# Altium schematic sheet Block_Diagram.SchDoc
size A3
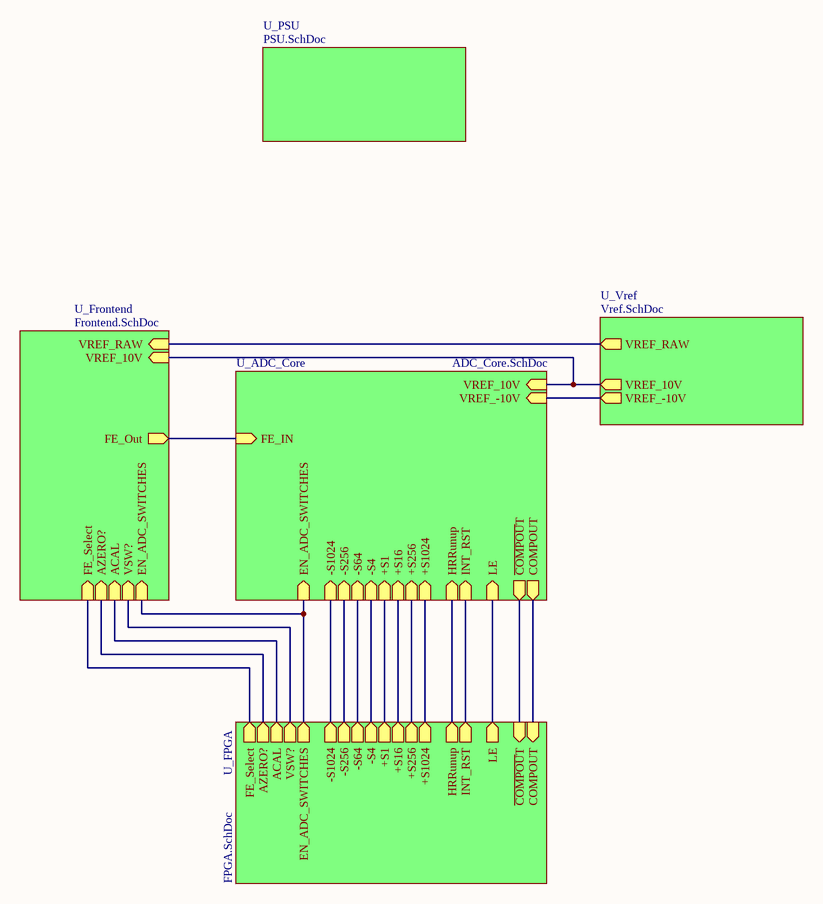
[diagram p0: Block_Diagram.SchDoc]

## Sub-sheets
U_ADC_Core = ADC_Core.SchDoc: FE_IN (in), -S64 (in), -S1024 (in), COMPOUT (out), +S16 (in), +S1024 (in), +S256 (in), LE (in), -S4 (in), INT_RST (in), ~{COMPOU}T (out), -S256 (in), HRRunup (in), +S1 (in), VREF_10V (in), VREF_-10V (in), EN_ADC_SWITCHES (in)
U_FPGA = FPGA.SchDoc: COMPOUT (in), ~{COMPOU}T (in), LE (out), INT_RST (out), HRRunup (out), +S1024 (out), +S256 (out), +S16 (out), +S1 (out), -S4 (out), -S64 (out), -S256 (out), -S1024 (out), EN_ADC_SWITCHES (out), VSW? (out), ACAL (out), AZERO? (out), FE_Select (out)
U_Frontend = Frontend.SchDoc: FE_Out (out), VREF_10V (in), VSW? (in), FE_Select (in), AZERO? (in), ACAL (in), VREF_RAW (in), EN_ADC_SWITCHES (in)
U_PSU = PSU.SchDoc: no entries
U_Vref = Vref.SchDoc: VREF_10V (out), VREF_-10V (out), VREF_RAW (out)

## Nets
(unnamed): sheet U_ADC_Core/FE_IN, sheet U_Frontend/FE_Out
(unnamed): sheet U_ADC_Core/-S64, sheet U_FPGA/-S64
(unnamed): sheet U_ADC_Core/-S1024, sheet U_FPGA/-S1024
(unnamed): sheet U_ADC_Core/COMPOUT, sheet U_FPGA/COMPOUT
(unnamed): sheet U_ADC_Core/+S16, sheet U_FPGA/+S16
(unnamed): sheet U_ADC_Core/+S1024, sheet U_FPGA/+S1024
(unnamed): sheet U_ADC_Core/+S256, sheet U_FPGA/+S256
(unnamed): sheet U_ADC_Core/LE, sheet U_FPGA/LE
(unnamed): sheet U_ADC_Core/-S4, sheet U_FPGA/-S4
(unnamed): sheet U_ADC_Core/INT_RST, sheet U_FPGA/INT_RST
(unnamed): sheet U_ADC_Core/~{COMPOU}T, sheet U_FPGA/~{COMPOU}T
(unnamed): sheet U_ADC_Core/-S256, sheet U_FPGA/-S256
(unnamed): sheet U_ADC_Core/HRRunup, sheet U_FPGA/HRRunup
(unnamed): sheet U_ADC_Core/+S1, sheet U_FPGA/+S1
(unnamed): sheet U_ADC_Core/VREF_10V, sheet U_Vref/VREF_10V, sheet U_Frontend/VREF_10V
(unnamed): sheet U_ADC_Core/VREF_-10V, sheet U_Vref/VREF_-10V
(unnamed): sheet U_ADC_Core/EN_ADC_SWITCHES, sheet U_Frontend/EN_ADC_SWITCHES, sheet U_FPGA/EN_ADC_SWITCHES
(unnamed): sheet U_Vref/VREF_RAW, sheet U_Frontend/VREF_RAW
(unnamed): sheet U_Frontend/VSW?, sheet U_FPGA/VSW?
(unnamed): sheet U_Frontend/FE_Select, sheet U_FPGA/FE_Select
(unnamed): sheet U_Frontend/AZERO?, sheet U_FPGA/AZERO?
(unnamed): sheet U_Frontend/ACAL, sheet U_FPGA/ACAL